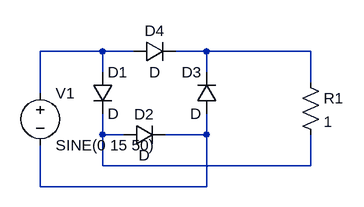
[diagram p0: schematic 2022023_3.asc]
2022023_3.asc, the LTspice schematic file:
Version 4
SHEET 1 880 680
WIRE 64 80 -32 80
WIRE 112 80 64 80
WIRE 224 80 176 80
WIRE 384 80 224 80
WIRE 64 112 64 80
WIRE 224 112 224 80
WIRE 384 128 384 80
WIRE -32 144 -32 80
WIRE 64 208 64 176
WIRE 96 208 64 208
WIRE 224 208 224 176
WIRE 224 208 160 208
WIRE 64 256 64 208
WIRE 384 256 384 208
WIRE 384 256 64 256
WIRE -32 288 -32 224
WIRE 224 288 224 208
WIRE 224 288 -32 288
SYMBOL diode 48 112 R0
SYMATTR InstName D1
SYMBOL diode 96 224 R270
WINDOW 0 32 32 VTop 2
WINDOW 3 0 32 VBottom 2
SYMATTR InstName D2
SYMBOL diode 240 176 R180
WINDOW 0 24 64 Left 2
WINDOW 3 24 0 Left 2
SYMATTR InstName D3
SYMBOL diode 112 96 R270
WINDOW 0 32 32 VTop 2
WINDOW 3 0 32 VBottom 2
SYMATTR InstName D4
SYMBOL voltage -32 128 R0
WINDOW 123 0 0 Left 0
WINDOW 39 0 0 Left 0
SYMATTR InstName V1
SYMATTR Value SINE(0 15 50)
SYMBOL res 368 112 R0
SYMATTR InstName R1
SYMATTR Value 1

The netlist it stands for:
* 2022023_3.asc
D1 N001 N003 D
D2 N003 N004 D
D3 N004 N002 D
D4 N001 N002 D
V1 N001 N004 SINE(0 15 50)
R1 N002 N003 1
.model D D
.lib standard.dio
.backanno
.end